# EAGLE board lisa_l (EAGLE 6.1), part 1 of 2
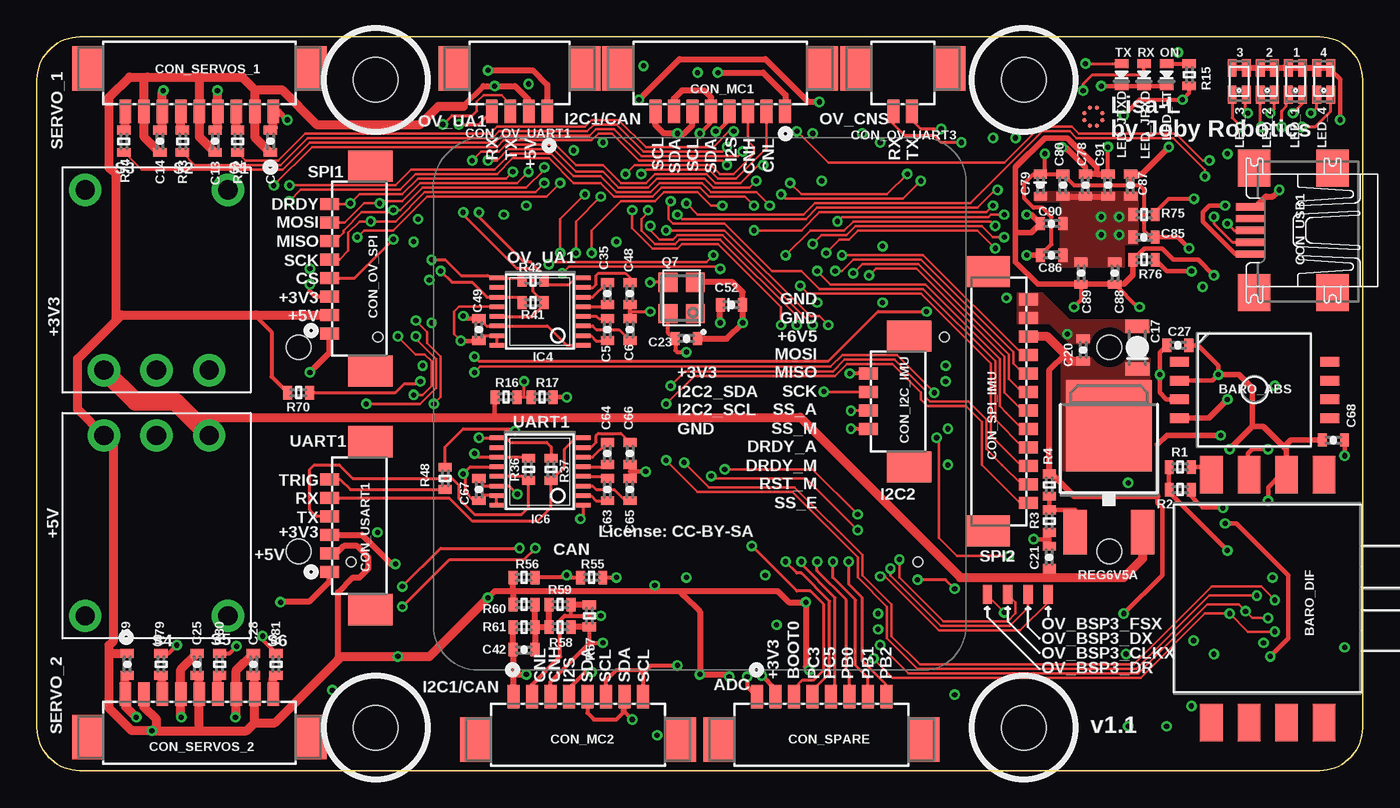
[diagram p6: board, top side]
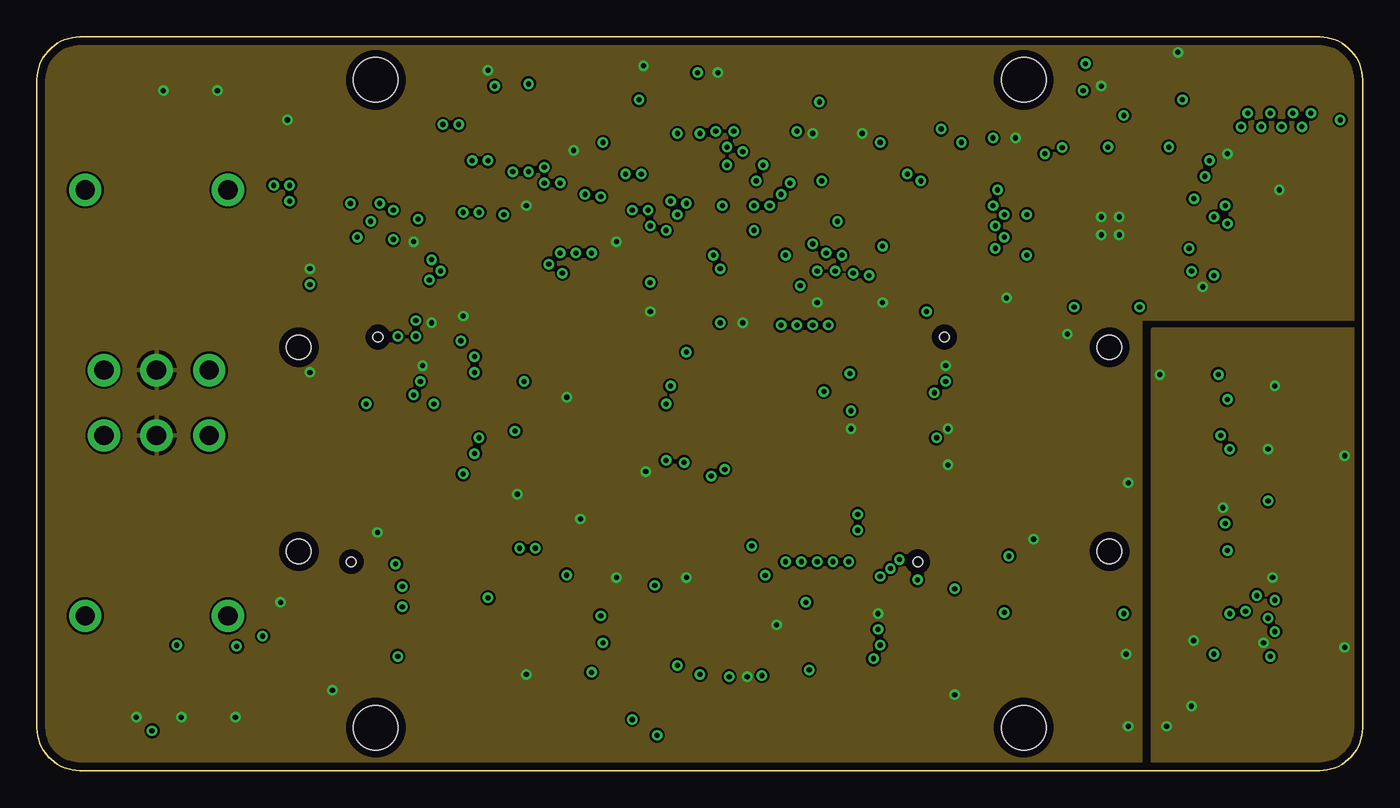
[diagram p7: board, inner layer Route2]
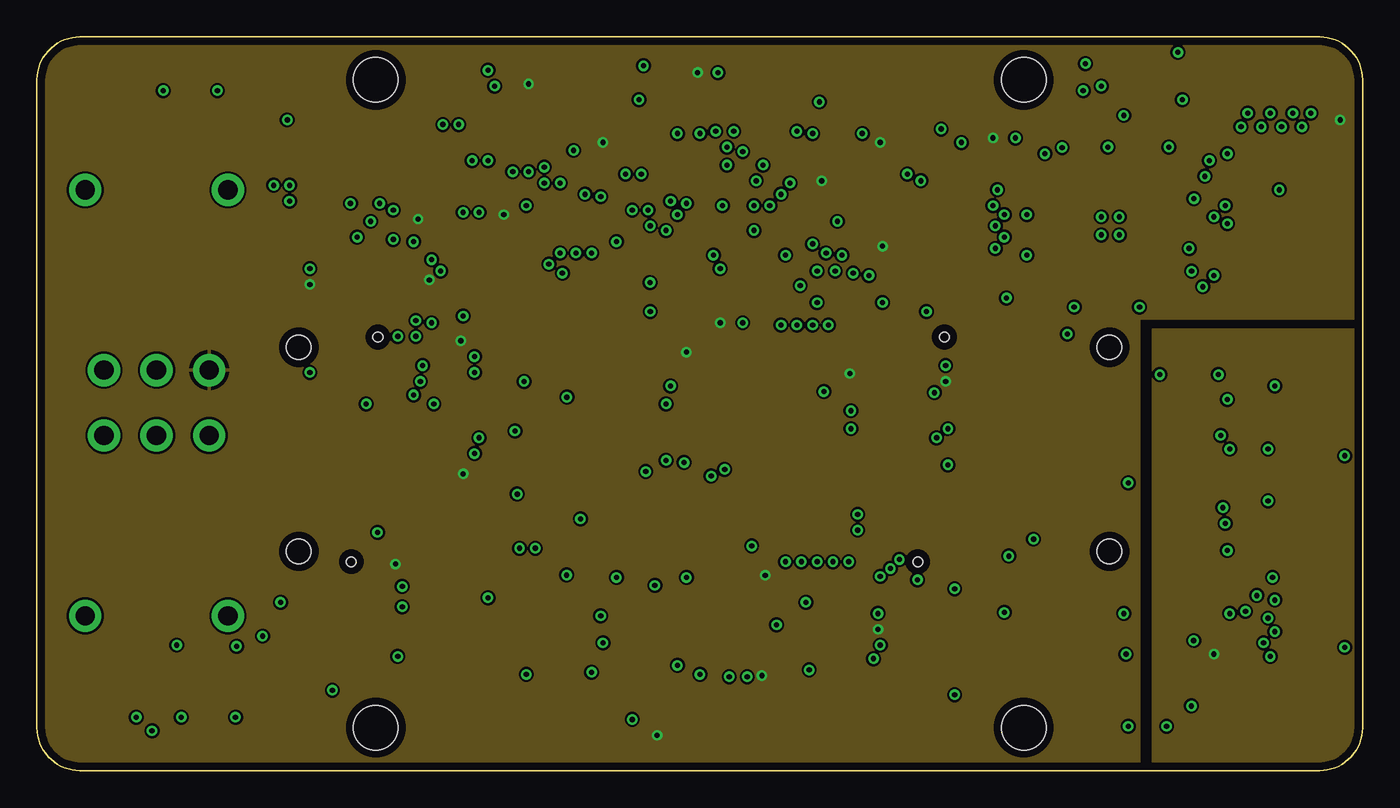
[diagram p8: board, inner layer Route15]
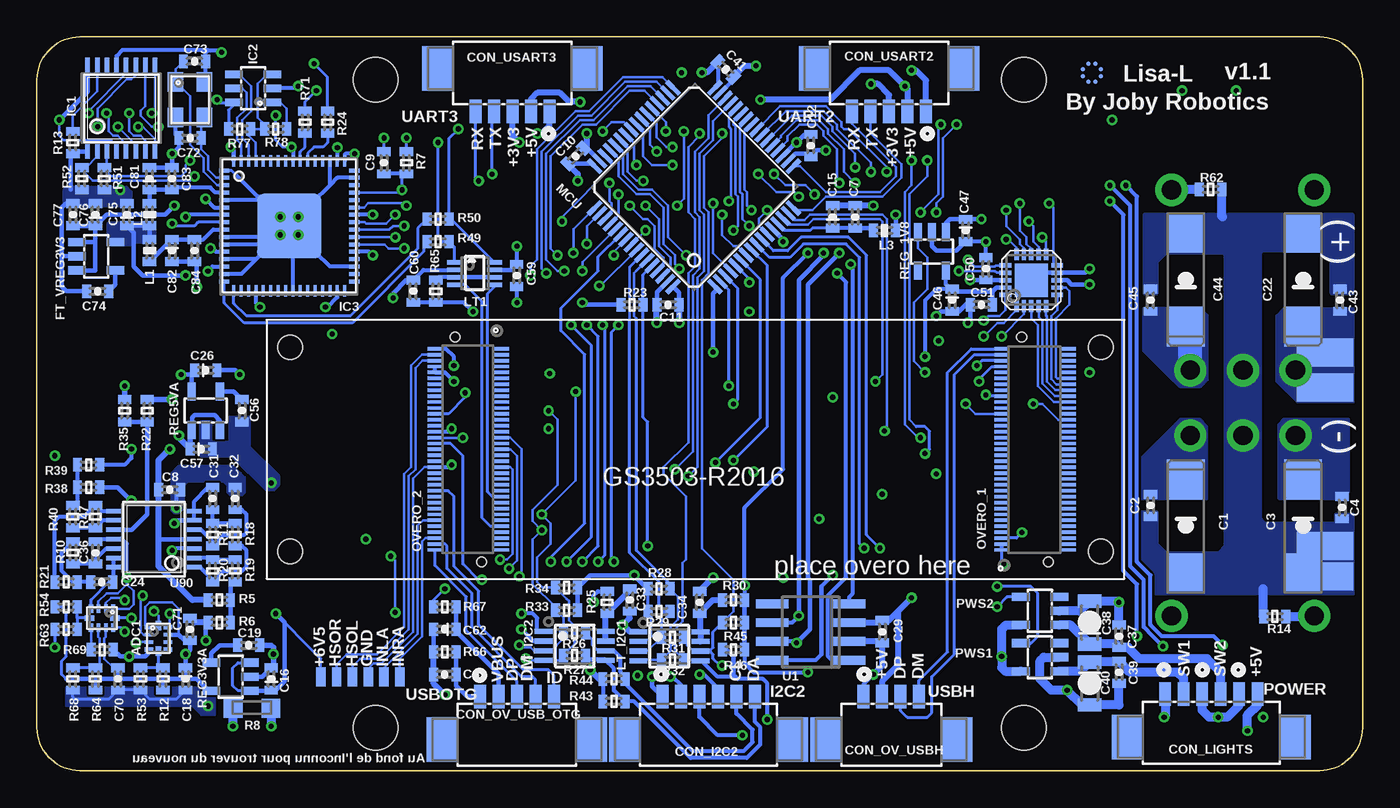
[diagram p9: board, bottom side, seen from below]

Size 89.6 x 49.6 mm. Coordinates in mm from the lower left corner, seen from the top.
Outline: 2.9,49.6 86.7,49.6 arc-90 89.6,46.7 89.6,2.9 arc-90 86.7,0 2.9,0 arc-90 0,2.9 0,46.7 arc-90 2.9,49.6
Copper layers (1*2+15*16): Top 0.035mm / dielectric 0.2mm / Route2 0.035mm / dielectric 1.5mm / Route15 0.035mm / dielectric 0.2mm / Bottom 0.035mm
Design rules: minimum track width 0.15mm, minimum drill 0.35mm, track to track 0.15mm, track to pad 0.15mm, pad to pad 0.15mm, via to via 0.15mm, smd to smd 0.15mm, copper to edge 20mil, drill to drill 8mil, minimum pad ring 0.177mm, minimum via ring 0.177mm, stop-mask expansion 4mil, vias tented up to drill 14mil, thermal gap 10mil
Net classes: 0 default: width 0.152 mm, drill 0.305 mm, clearance 0.152 mm; 1 supply: width 0.203 mm; 4 xxwide: width 0.203 mm; 5 USB: width 0.191 mm
Holes 3 mm at 66.7,46.7 66.7,2.9 22.9,46.7 22.9,2.9
bKeepout: area 19.9,43.7 to 25.9,49.7; area 63.7,43.7 to 69.7,49.7; area 19.9,-0.1 to 25.9,5.9; area 63.7,-0.1 to 69.7,5.9
tRestrict: area 63.6,43.6 to 69.8,49.8; area 63.6,-0.2 to 69.8,6; area 19.8,-0.2 to 26,6; area 19.8,43.6 to 26,49.8

## Footprints (pad centres in the part's own frame; a part is rotated, then mirrored left to right if it is on the bottom)
R-PQFP-N10 = smd 0.3 x 0.58: P$1 0.75,0.637; P$4 -0.75,0.637; P$6 -0.75,-0.637; P$9 0.75,-0.637 | smd 0.25 x 0.58: P$2 0.25,0.637; P$3 -0.25,0.637; P$7 -0.25,-0.637; P$8 0.25,-0.637 | smd 0.63 x 0.35: P$5 -0.863,0; P$10 0.863,0
CASE_1317 = smd 1.27 x 0.635: P$1 5.08,-1.905; P$2 5.08,-0.635; P$3 5.08,0.635; P$4 5.08,1.905; P$5 -5.08,1.905; P$6 -5.08,0.635; P$7 -5.08,-0.635; P$8 -5.08,-1.905
CASE1351 = smd 2.54 x 1.524: P$1 8.382,-3.81; P$2 8.382,-1.27; P$3 8.382,1.27; P$4 8.382,3.81; P$5 -8.382,3.81; P$6 -8.382,1.27; P$7 -8.382,-1.27; P$8 -8.382,-3.81
SOLD_PAD_150_75 = smd 3.81 x 1.905: P$1 0,0
7343/D = smd 2.7 x 2.55: + -3.175,0; - 3.175,0
0603-CAP = smd 0.6 x 0.9: P$1 -0.75,0; P$2 0.75,0
0603-POL-CAP = smd 0.6 x 0.9: + -0.75,0; - 0.75,0
1206-POL-CAP = smd 0.9 x 1.6: + -1.45,0; - 1.45,0
PB-53261-06 = smd 0.8 x 1.6: 1 -3.125,1.1; 2 -1.875,1.1; 3 -0.625,1.1; 4 0.625,1.1; 5 1.875,1.1; 6 3.125,1.1 | smd 2.1 x 3: MNT1 -5.675,-1.8; MNT2 5.675,-1.8
PB-53398-04 = smd 0.8 x 1.3: 1 -1.875,1.25; 2 -0.625,1.25; 3 0.625,1.25; 4 1.875,1.25 | smd 2.1 x 3: PAD1 -4.425,-1.5; PAD2 4.425,-1.5
PB-53261-08 = smd 0.8 x 1.6: 1 -4.375,1.1; 2 -3.125,1.1; 3 -1.875,1.1; 4 -0.625,1.1; 5 0.625,1.1; 6 1.875,1.1; 7 3.125,1.1; 8 4.375,1.1 | smd 2.1 x 3: MNT1 -6.925,-1.8; MNT2 6.925,-1.8
PB-53398-08 = smd 0.8 x 1.3: 1 -4.375,1.25; 2 -3.125,1.25; 3 -1.875,1.25; 4 -0.625,1.25; 5 0.625,1.25; 6 1.875,1.25; 7 3.125,1.25; 8 4.375,1.25 | smd 2.1 x 3: PAD1 -6.925,-1.5; PAD2 6.925,-1.5
PB-53261-04 = smd 0.8 x 1.6: 1 -1.875,1.1; 2 -0.625,1.1; 3 0.625,1.1; 4 1.875,1.1 | smd 2.1 x 3: MNT1 -4.425,-1.8; MNT2 4.425,-1.8
PB-53261-02 = smd 0.8 x 1.6: 1 -0.625,1.1; 2 0.625,1.1 | smd 2.1 x 3: MNT1 -3.175,-1.8; MNT2 3.175,-1.8
PB-53261-05 = smd 0.8 x 1.6: 1 -2.5,1.1; 2 -1.25,1.1; 3 0,1.1; 4 1.25,1.1; 5 2.5,1.1 | smd 2.1 x 3: MNT1 -5.05,-1.8; MNT2 5.05,-1.8
PB-53261-09 = smd 0.8 x 1.6: 1 -5,1.1; 2 -3.75,1.1; 3 -2.5,1.1; 4 -1.25,1.1; 5 0,1.1; 6 1.25,1.1; 7 2.5,1.1; 8 3.75,1.1; 9 5,1.1 | smd 2.1 x 3: MNT1 -7.55,-1.8; MNT2 7.55,-1.8
PB-53398-12 = smd 0.8 x 1.3: 1 -6.875,1.25; 2 -5.625,1.25; 3 -4.375,1.25; 4 -3.125,1.25; 5 -1.875,1.25; 6 -0.625,1.25; 7 0.625,1.25; 8 1.875,1.25; 9 3.125,1.25; 10 4.375,1.25; 11 5.625,1.25; 12 6.875,1.25 | smd 2.1 x 3: PAD1 -8.775,-1.5; PAD2 8.775,-1.5
PB-53398-06 = smd 0.8 x 1.3: 1 -3.125,1.25; 2 -1.875,1.25; 3 -0.625,1.25; 4 0.625,1.25; 5 1.875,1.25; 6 3.125,1.25 | smd 2.1 x 3: PAD1 -5.675,-1.5; PAD2 5.675,-1.5
UX60A-MB-5ST = smd 2 x 0.5: 1 2.25,1.6; 2 2.25,0.8; 3 2.25,0; 4 2.25,-0.8; 5 2.25,-1.6 | smd 2.2 x 2.5: M1 -3.3,-4.2; M2 -3.3,4.2; M3 2,4.2; M4 2,-4.2
SOT23-5 = smd 0.55 x 1.2: 1 -0.95,-1.3; 2 0,-1.3; 3 0.95,-1.3; 4 0.95,1.3; 5 -0.95,1.3
TSSOP16 = smd 0.305 x 0.991: 1 -2.275,-2.918; 2 -1.625,-2.918; 3 -0.975,-2.918; 4 -0.325,-2.918; 5 0.325,-2.918; 6 0.975,-2.918; 7 1.625,-2.918; 8 2.275,-2.918; 9 2.275,2.918; 10 1.625,2.918; 11 0.975,2.918; 12 0.325,2.918; 13 -0.325,2.918; 14 -0.975,2.918; 15 -1.625,2.918; 16 -2.275,2.918
SO23-6 = smd 0.5 x 1.2: 1 -0.95,-1.3; 2 0,-1.3; 3 0.95,-1.3; 4 0.95,1.3; 5 0,1.3; 6 -0.95,1.3
QFN64 = smd 0.75 x 0.25: P$1 -4.4,3.75; P$2 -4.4,3.25; P$3 -4.4,2.75; P$4 -4.4,2.25; P$5 -4.4,1.75; P$6 -4.4,1.25; P$7 -4.4,0.75; P$8 -4.4,0.25; P$9 -4.4,-0.25; P$10 -4.4,-0.75; P$11 -4.4,-1.25; P$12 -4.4,-1.75; P$13 -4.4,-2.25; P$14 -4.4,-2.75; P$15 -4.4,-3.25; P$16 -4.4,-3.75; P$33 4.4,-3.75; P$34 4.4,-3.25; P$35 4.4,-2.75; P$36 4.4,-2.25; P$37 4.4,-1.75; P$38 4.4,-1.25; P$39 4.4,-0.75; P$40 4.4,-0.25; P$41 4.4,0.25; P$42 4.4,0.75; P$43 4.4,1.25; P$44 4.4,1.75; P$45 4.4,2.25; P$46 4.4,2.75; P$47 4.4,3.25; P$48 4.4,3.75 | smd 0.25 x 0.75: P$17 -3.75,-4.4; P$18 -3.25,-4.4; P$19 -2.75,-4.4; P$20 -2.25,-4.4; P$21 -1.75,-4.4; P$22 -1.25,-4.4; P$23 -0.75,-4.4; P$24 -0.25,-4.4; P$25 0.25,-4.4; P$26 0.75,-4.4; P$27 1.25,-4.4; P$28 1.75,-4.4; P$29 2.25,-4.4; P$30 2.75,-4.4; P$31 3.25,-4.4; P$32 3.75,-4.4; P$49 3.75,4.4; P$50 3.25,4.4; P$51 2.75,4.4; P$52 2.25,4.4; P$53 1.75,4.4; P$54 1.25,4.4; P$55 0.75,4.4; P$56 0.25,4.4; P$57 -0.25,4.4; P$58 -0.75,4.4; P$59 -1.25,4.4; P$60 -1.75,4.4; P$61 -2.25,4.4; P$62 -2.75,4.4; P$63 -3.25,4.4; P$64 -3.75,4.4 | smd 4.35 x 4.35: P$65 0,0
OVERO = smd 1 x 0.23: ADCIN2 17.6,-2; ADCIN3 17.6,2; ADCIN4 17.6,5.2; ADCIN5 17.6,0.8; ADCIN6 17.6,0; ADCIN7 17.6,-4.4; AGND 17.6,1.2; AUXLF 17.6,6; AUXRF 17.6,4.8; EM_A1 -25.2,2; EM_A2 -20.7,2.8; EM_A3 -25.2,2.4; EM_A4 -25.2,3.2; EM_A5 -20.7,2; EM_A6 -25.2,1.6; EM_A7 -20.7,1.6; EM_A8 -20.7,2.4; EM_A9 -25.2,3.6; EM_A10 -25.2,2.8; EM_CLK -25.2,6.8; EM_D0 -25.2,1.2; EM_D1 -25.2,0; EM_D2 -20.7,1.2; EM_D3 -20.7,0.4; EM_D4 -20.7,-0.4; EM_D5 -20.7,-1.2; EM_D6 -25.2,-0.8; EM_D7 -25.2,-1.6; EM_D8 -25.2,0.4; EM_D9 -25.2,0.8; EM_D10 -20.7,0.8; EM_D11 -20.7,0; EM_D12 -20.7,-0.8; EM_D13 -25.2,-0.4; EM_D14 -25.2,-1.2; EM_D15 -20.7,-1.6; EM_NADV_ALE -20.7,4.4; EM_NBE0 -25.2,4.8; EM_NBE1 -25.2,6.4; EM_NCS0 -25.2,5.2; EM_NCS1 -25.2,4.4; EM_NCS4 -20.7,5.2; EM_NCS5_ETH0 -20.7,5.6; EM_NCS6 -25.2,5.6; EM_NOE -20.7,4; EM_NWE -20.7,4.8; EM_NWP -25.2,4; EM_WAIT0 -25.2,6; GND -20.7,6; GND@33 -20.7,-6; GND@56 17.6,-1.2; GND@70 17.6,-6.8; GPIO0_WAKEUP 13.1,-3.6; GPIO12_MMC3_CLK -25.2,-5.2; GPIO13_MMC3_CMD -20.7,-2; GPIO14_MMC3_DAT4 -20.7,-4.4; GPIO17_MMC3_D3 -20.7,-5.2; GPIO18_MMC3_D0 -20.7,-3.2; GPIO19_MMC3_D1 -25.2,-6.8; GPIO20_MMC3_D2 -25.2,-5.6; GPIO21_MMC3_DAT7 -20.7,-4.8; GPIO22_MMC3_DAT6 -25.2,-6.4; GPIO23_MMC3_DAT5 -25.2,-6; GPIO64_ETH0_NRESET -20.7,3.2; GPIO65_ETH1_IRQ1 -20.7,3.6; GPIO66_L_PCLK 13.1,5.6; GPIO67_L_LCLK 13.1,6.8; GPIO68_L_FCLK 13.1,6.4; GPIO69_L_BIAS 17.6,4; GPIO70_L_DD00 13.1,-6; GPIO71_L_DD01 13.1,-6.4; GPIO72_L_DD02 13.1,-4.8; GPIO73_L_DD03 13.1,-5.6; GPIO74_L_DD04 13.1,-4.4; GPIO75_L_DD05 13.1,-5.2; GPIO76_L_DD06 13.1,6; GPIO77_L_DD07 13.1,4.4; GPIO78_L_DD08 13.1,4.8; GPIO79_L_DD09 13.1,4; GPIO80_L_DD10 13.1,-2.8; GPIO81_L_DD11 13.1,-2.4; GPIO82_L_DD12 17.6,-2.8; GPIO83_L_DD13 13.1,-0.4; GPIO84_L_DD14 13.1,0.4; GPIO85_L_DD15 13.1,0.8; GPIO86_L_DD16 17.6,3.6; GPIO87_L_DD17 13.1,2.4; GPIO88_L_DD18 13.1,2.8; GPIO89_L_DD19 13.1,3.6; GPIO90_L_DD20 17.6,3.2; GPIO91_L_DD21 13.1,2; GPIO92_L_DD22 13.1,-1.2; GPIO93_L_DD23 17.6,-3.2; GPIO114_SPI1_NIRQ -25.2,-4.8; GPIO127_TS_IRQ 13.1,-4; GPIO128_GPS_PPS 13.1,-1.6; GPIO144_GPT9_PWM 13.1,0; GPIO145_GPT10_PWM 17.6,-0.8; GPIO146_GPT11_PWM 13.1,1.2; GPIO147_GPT8_PWM 13.1,-0.8; GPIO148_TXD1 -20.7,-2.4; GPIO149_MMC3_CD -25.2,-2.8; GPIO150_MMC3_WP -25.2,-2.4; GPIO151_RXD1 -25.2,-2; GPIO163_IR_CTS3 13.1,1.6; GPIO165_IR_RXD3 13.1,5.2; GPIO166_IR_TXD3 13.1,3.2; GPIO168_USBH_CPEN -20.7,-4; GPIO170_HDQ_1WIRE 17.6,2.4; GPIO171_SPI1_CLK -25.2,-4; GPIO172_SPI1_MOSI -25.2,-3.6; GPIO173_SPI1_MISO -25.2,-3.2; GPIO174_SPI1_CS0 -20.7,-3.6; GPIO175_SPI1_CS1 -25.2,-4.4; GPIO176_ETH0_IRQ -20.7,-2.8; GPIO184_I2C3_SCL 13.1,-2; GPIO185_I2C3_SDA 13.1,-3.2; HSOLF 17.6,-6; HSORF 17.6,-6.4; MIC_MAIN_MF 17.6,-1.6; MIC_SUB_MF 17.6,5.6; N_MANUAL_RESET 13.1,-6.8; NC@62 17.6,-3.6; NC@63 17.6,-4; POWERON 17.6,-4.8; PWM0 17.6,4.4; PWM1 17.6,1.6; SYSEN 17.6,-2.4; USBH_DM -20.7,-6.8; USBH_DP -20.7,-6.4; USBH_VBUS -20.7,-5.6; USBOTG_DM 17.6,6.4; USBOTG_DP 17.6,6.8; USBOTG_ID 17.6,2.8; USBOTG_VBUS 17.6,-0.4; VBACKUP 17.6,0.4; VSYSTEM@1 -20.7,6.8; VSYSTEM@2 -20.7,6.4; VSYSTEM@66 17.6,-5.2; VSYSTEM@67 17.6,-5.6 | hole 1.65: 27.4,6.9; 27.4,-6.9; -27.4,6.9; -27.4,-6.9 | hole 0.65: -23.85,7.6; -22.05,-7.6; 14.45,7.6; 16.25,-7.6
JOBY_LOGO_12MIL = smd 0.305 x 0.305: 1 -0.229,0.61; 2 0.229,0.61; 3 0.61,0.229; 4 0.61,-0.229; 5 0.229,-0.61; 6 -0.229,-0.61; 7 -0.61,-0.229; 8 -0.61,0.229
0603-IND = smd 0.6 x 0.9: P$1 -0.75,0; P$2 0.75,0
DUO_LED = smd 1.2 x 0.6: 1 0.9,0.475; 2 -0.9,0.475; 3 -0.9,-0.475; 4 0.9,-0.475
0603-LED = smd 0.6 x 0.9: A 0.75,0; C -0.75,0
US8 = smd 0.3 x 1: 1 -0.75,-1.35; 2 -0.25,-1.35; 3 0.25,-1.35; 4 0.75,-1.35; 5 0.75,1.35; 6 0.25,1.35; 7 -0.25,1.35; 8 -0.75,1.35
LFCSP-20 = smd 0.8 x 0.3: P$1 -1.75,1; P$2 -1.75,0.5; P$3 -1.75,0; P$4 -1.75,-0.5; P$5 -1.75,-1; P$11 1.75,-1; P$12 1.75,-0.5; P$13 1.75,0; P$14 1.75,0.5; P$15 1.75,1 | smd 0.3 x 0.8: P$6 -1,-1.75; P$7 -0.5,-1.75; P$8 0,-1.75; P$9 0.5,-1.75; P$10 1,-1.75; P$16 1,1.75; P$17 0.5,1.75; P$18 0,1.75; P$19 -0.5,1.75; P$20 -1,1.75 | smd 2.25 x 2.25: P$21 0,0
TSSOP_B3 = smd 1.2 x 0.35: 1 -2.925,0.975; 2 -2.925,0.325; 3 -2.925,-0.325; 4 -2.925,-0.975; 5 1.275,-0.975; 6 1.275,-0.325; 7 1.275,0.325; 8 1.275,0.975
LQFP64 = smd 1.2 x 0.3: 1 -5.75,3.75; 2 -5.75,3.25; 3 -5.75,2.75; 4 -5.75,2.25; 5 -5.75,1.75; 6 -5.75,1.25; 7 -5.75,0.75; 8 -5.75,0.25; 9 -5.75,-0.25; 10 -5.75,-0.75; 11 -5.75,-1.25; 12 -5.75,-1.75; 13 -5.75,-2.25; 14 -5.75,-2.75; 15 -5.75,-3.25; 16 -5.75,-3.75; 33 5.75,-3.75; 34 5.75,-3.25; 35 5.75,-2.75; 36 5.75,-2.25; 37 5.75,-1.75; 38 5.75,-1.25; 39 5.75,-0.75; 40 5.75,-0.25; 41 5.75,0.25; 42 5.75,0.75; 43 5.75,1.25; 44 5.75,1.75; 45 5.75,2.25; 46 5.75,2.75; 47 5.75,3.25; 48 5.75,3.75 | smd 0.3 x 1.2: 17 -3.75,-5.75; 18 -3.25,-5.75; 19 -2.75,-5.75; 20 -2.25,-5.75; 21 -1.75,-5.75; 22 -1.25,-5.75; 23 -0.75,-5.75; 24 -0.25,-5.75; 25 0.25,-5.75; 26 0.75,-5.75; 27 1.25,-5.75; 28 1.75,-5.75; 29 2.25,-5.75; 30 2.75,-5.75; 31 3.25,-5.75; 32 3.75,-5.75; 49 3.75,5.75; 50 3.25,5.75; 51 2.75,5.75; 52 2.25,5.75; 53 1.75,5.75; 54 1.25,5.75; 55 0.75,5.75; 56 0.25,5.75; 57 -0.25,5.75; 58 -0.75,5.75; 59 -1.25,5.75; 60 -1.75,5.75; 61 -2.25,5.75; 62 -2.75,5.75; 63 -3.25,5.75; 64 -3.75,5.75
SOT23-5L = smd 0.55 x 1.2: 1 -0.95,-1.3; 2 0,-1.3; 3 0.95,-1.3; 4 0.95,1.3; 5 -0.95,1.3
ABM8 = smd 1.3 x 1.05: P$1 -1.2,-0.975; P$2 1.2,-0.975; P$3 1.2,0.975; P$4 -1.2,0.975
ASE_OSCILLATOR = smd 1.295 x 1.27: 1 -1.041,-0.902; 2 1.067,-0.902; 3 1.067,0.927; 4 -1.041,0.927
0603-RES = smd 0.6 x 0.9: P$1 -0.75,0; P$2 0.75,0
DPACK = smd 1.6 x 3: 1 -2.28,-4.8; 3 2.28,-4.8 | smd 5.8 x 6.2: 4 0,2.38
SOT-23-5 = smd 0.55 x 1.2: 1 -0.95,-1.3; 2 0,-1.3; 3 0.95,-1.3; 4 0.95,1.3; 5 -0.95,1.3
PTH_TH = drill 1.3 pad 2.184: P$1 -6.096,3.556; P$2 -6.096,0; P$3 -6.096,-3.556; P$4 6.096,-4.826; P$5 6.096,4.826
SO-08 = smd 0.6 x 2.2: 1 -1.905,-2.6; 2 -0.635,-2.6; 3 0.635,-2.6; 4 1.905,-2.6; 5 1.905,2.6; 6 0.635,2.6; 7 -0.635,2.6; 8 -1.905,2.6
TSSOP14 = smd 0.305 x 0.991: 1 -1.905,-2.718; 2 -1.27,-2.718; 3 -0.635,-2.718; 4 0,-2.718; 5 0.635,-2.718; 6 1.27,-2.718; 7 1.905,-2.718; 8 1.905,2.718; 9 1.27,2.718; 10 0.635,2.718; 11 0,2.718; 12 -0.635,2.718; 13 -1.27,2.718; 14 -1.905,2.718
SOLDER_PAD_SMALL = smd 1.27 x 0.635: P$1 0,0
GND-GNDA = smd 1.27 x 1.27: GND -1.27,0; GNDA 1.27,0

## Placement (x,y rotation side)
ADC1  ADS1114  [R-PQFP-N10]  81.39,8.94 90 bottom
ADC2  ADS1114  [R-PQFP-N10]  85.2,10.31 0 bottom
BARO_ABS  MPX6115  [CASE_1317]  82.3,25.73 180 top
BARO_DIF  MPXV5004DP  [CASE1351]  83.19,11.63 90 top
BAT_IN  SOLDER_PAD150_75  [SOLD_PAD_150_75]  2.52,28.27 0 bottom
BAT_IN1  SOLDER_PAD150_75  [SOLD_PAD_150_75]  2.52,25.91 0 bottom
C1  100uF/20V  [7343/D]  11.95,16.51 270 bottom
C2  100nF  [0603-CAP]  14.33,17.93 270 bottom
C3  220uF/10V  [7343/D]  4.02,16.51 270 bottom
C4  100nF  [0603-CAP]  1.38,17.78 270 bottom
C5  100nF  [0603-CAP]  38.56,29.82 90 top
C6  100nF  [0603-CAP]  40.09,29.82 270 top
C7  10nF  [0603-CAP]  34.29,37.44 270 bottom
C8  100nF  [0603-CAP]  80.62,19 0 bottom
C9  100nF  [0603-CAP]  66.15,41.09 270 bottom
C10  100nF  [0603-CAP]  53.19,41.55 225 bottom
C11  100nF  [0603-CAP]  46.94,31.49 0 bottom
C12  100nF  [0603-CAP]  37.29,42.26 90 bottom
C13  100nF  [0603-CAP]  12.04,42.54 270 top
C14  100nF  [0603-CAP]  8.31,42.54 270 top
C15  1uF  [0603-POL-CAP]  35.82,37.44 90 bottom
C16  2.2uF/Low ESR  [0603-POL-CAP]  73.77,6.19 90 bottom
C17  22uF/10V  [1206-POL-CAP]  74.38,28.6 90 top
C18  4.7uF/10V/Low ESR  [0603-POL-CAP]  79.56,6.19 270 bottom
C19  10nF/16V  [0603-CAP]  75.29,8.48 0 bottom
C20  100nF  [0603-CAP]  70.72,28.44 90 top
C21  100nF  [0603-CAP]  68.43,14.42 90 top
C22  100uF/20V  [7343/D]  4.02,33.2 90 bottom
C23  10nF  [0603-CAP]  43.9,29.21 180 top
C24  330nF  [0603-CAP]  85.22,12.75 180 bottom
C25  100nF  [0603-CAP]  10.82,7.18 270 top
C26  4.7uF/10V/Low ESR  [0603-POL-CAP]  78.19,27.07 0 bottom
C27  100nF  [0603-CAP]  77.12,28.75 180 top
C28  100nF  [0603-CAP]  14.63,7.18 270 top
C29  100nF  [0603-CAP]  32.47,9.39 270 bottom
C30  100nF  [0603-CAP]  15.78,42.54 270 top
C31  330nF  [0603-CAP]  77.73,18.39 270 bottom
C32  170nF  [0603-CAP]  76.2,18.39 270 bottom
C33  100nF  [0603-CAP]  49.53,11.53 270 bottom
C34  100nF  [0603-CAP]  44.81,11.38 90 bottom
C35  100nF  [0603-CAP]  38.56,32.25 90 top
C36  170nF  [0603-CAP]  85.65,14.73 270 bottom
C37  100nF  [0603-CAP]  16.46,9.09 90 bottom
C38  33uF/6V  [1206-POL-CAP]  18.44,10 90 bottom
C39  100nF  [0603-CAP]  16.46,6.65 270 bottom
C40  33uF/6V  [1206-POL-CAP]  18.44,5.89 270 bottom
C41  100nF  [0603-CAP]  43.04,47.41 135 bottom
C42  4.7nF  [0603-CAP]  32.92,8.18 0 top
C43  100nF  [0603-CAP]  1.53,31.8 90 bottom
C44  220uF/10V  [7343/D]  11.95,33.2 90 bottom
C45  100nF  [0603-CAP]  14.33,31.8 90 bottom
C46  10uF  [0603-POL-CAP]  27.74,31.8 270 bottom
C47  10uF  [0603-POL-CAP]  26.83,36.52 270 bottom
C48  100nF  [0603-CAP]  40.09,32.25 90 top
C49  100nF  [0603-CAP]  29.87,29.82 90 top
C50  100nF  [0603-CAP]  25.46,33.93 90 bottom
C51  100nF  [0603-CAP]  25.76,31.49 180 bottom
C52  4.7uF/10V/Low ESR  [0603-POL-CAP]  46.94,31.49 0 top
C56  10nF/16V  [0603-CAP]  75.75,24.33 270 bottom
C57  2.2uF/Low ESR  [0603-POL-CAP]  78.49,21.74 0 bottom
C59  100nF  [0603-CAP]  57.18,33.47 270 bottom
C60  100nF  [0603-CAP]  64.16,32.41 90 bottom
C61  10nF  [0603-CAP]  62.03,6.5 180 bottom
C62  4.7uF  [0603-POL-CAP]  62.03,9.55 180 bottom
C63  100nF  [0603-CAP]  38.56,19 90 top
C64  100nF  [0603-CAP]  38.56,21.43 90 top
C65  100nF  [0603-CAP]  40.09,19 90 top
C66  100nF  [0603-CAP]  40.09,21.43 270 top
C67  100nF  [0603-CAP]  29.87,19 270 top
C68  100nF  [0603-CAP]  87.63,22.35 0 top
C69  100nF  [0603-CAP]  6.1,7.18 90 top
C70  100nF  [0603-CAP]  84.13,6.19 270 bottom
C71  100nF  [0603-CAP]  79.25,9.55 90 bottom
C72  30pF  [0603-CAP]  79.25,42.77 0 bottom
C73  30pF  [0603-CAP]  78.95,47.95 180 bottom
C74  470pF  [0603-CAP]  85.5,32.41 0 bottom
C75  4.7uF/low ESR  [0603-POL-CAP]  83.52,37.59 90 bottom
C76  2.2uF/low ESR  [0603-POL-CAP]  85.65,37.59 90 bottom
C77  100nF  [0603-CAP]  87.18,37.59 270 bottom
C78  100nF  [0603-CAP]  70.87,39.57 90 top
C79  4.7uF  [0603-POL-CAP]  67.82,39.57 270 top
C80  100nF  [0603-CAP]  69.35,39.57 90 top
C81  4.7uF  [0603-POL-CAP]  82,40.03 90 bottom
C82  4.7uF  [0603-POL-CAP]  80.47,35.15 270 bottom
C83  100nF  [0603-CAP]  80.47,40.03 90 bottom
C84  100nF  [0603-CAP]  78.95,35.15 270 bottom
C85  100nF  [0603-CAP]  74.83,36.06 0 top
C86  100nF  [0603-CAP]  68.58,34.85 180 top
C87  100nF  [0603-CAP]  73.92,39.57 90 top
C88  100nF  [0603-CAP]  72.85,33.63 270 top
C89  100nF  [0603-CAP]  70.57,33.63 270 top
C90  100nF  [0603-CAP]  68.58,36.98 180 top
C91  100nF  [0603-CAP]  72.39,39.57 90 top
CON_I2C2  0  [PB-53261-06]  44.2,3.91 0 bottom
CON_I2C_IMU  [PB-53398-04]  57.46,24.96 90 top
CON_LIGHTS  0  [PB-53261-06]  10.22,4.06 0 bottom
CON_MC1  0  [PB-53261-08]  46.18,45.67 180 top
CON_MC2  0  [PB-53261-08]  36.58,3.91 0 top
CON_OV_SPI  0  [PB-53398-08]  21.04,33.93 90 top
CON_OV_UART1  0  [PB-53261-04]  32.62,45.67 180 top
CON_OV_UART3  0  [PB-53261-02]  58.53,45.67 180 top
CON_OV_USB_OTG  0  [PB-53261-05]  57.15,3.91 0 bottom
CON_OV_USBH  0  [PB-53261-04]  31.86,3.91 0 bottom
CON_SERVOS_1  0  [PB-53261-09]  10.98,45.67 180 top
CON_SERVOS_2  0  [PB-53261-09]  10.98,4.06 0 top
CON_SPARE  0  [PB-53261-08]  53.04,3.91 0 top
CON_SPI_IMU  0  [PB-53398-12]  65.77,24.96 270 top
CON_USART1  0  [PB-53398-06]  21.04,16.56 90 top
CON_USART2  0  [PB-53261-05]  32.01,45.67 180 bottom
CON_USART3  0  [PB-53261-05]  57.46,45.67 180 bottom
CON_USB1  MINI-USB-UX60A-MB-5ST  [UX60A-MB-5ST]  84.28,36.52 180 top
FT_VREG3V3  MIC5219  [SOT23-5]  85.6,34.77 270 bottom
GND_IN  SOLDER_PAD150_75  [SOLD_PAD_150_75]  2.52,15.19 0 bottom
GND_IN1  SOLDER_PAD150_75  [SOLD_PAD_150_75]  2.52,13.13 180 bottom
IC1  STP08CP05  [TSSOP16]  83.9,44.78 0 bottom
IC2  93C46-SO23-6  [SO23-6]  74.99,46.12 90 bottom
IC3  FT2232HQ  [QFN64]  72.55,36.83 0 bottom
IC4  MAX3221EUE  [TSSOP16]  33.99,31.04 90 top
IC6  MAX3221CUE  [TSSOP16]  33.99,20.22 90 top
J3&4  OVERO  [OVERO]  45.09,21.72 180 bottom
JL1  JOBY_LOGO-12MIL  [JOBY_LOGO_12MIL]  71.4,44.22 0 top
JL2  JOBY_LOGO-12MIL  [JOBY_LOGO_12MIL]  18.29,47.19 0 bottom
L1  [0603-IND]  82,35.15 270 bottom
L2  [0603-IND]  82,37.59 90 bottom
L3  [0603-IND]  32.31,36.52 180 bottom
LED_1  LED_DUO  [DUO_LED]  85.07,46.61 90 top
LED_2  LED_DUO  [DUO_LED]  83.16,46.61 90 top
LED_3  LED_DUO  [DUO_LED]  81.26,46.61 90 top
LED_4  LED_DUO  [DUO_LED]  86.97,46.61 90 top
LED_FT  [0603-LED]  76.36,47.04 90 top
LED_JRXD  [0603-LED]  74.83,47.04 90 top
LED_JTXD  [0603-LED]  73.31,47.04 90 top
LT1  TXS0102DCU  [US8]  60.02,33.6 270 bottom
LT_3  AD3308BCPZ  [LFCSP-20]  22.39,33.16 90 bottom
LT_I2C1  PCA9306DP  [TSSOP_B3]  46.03,8.4 0 bottom
LT_I2C2  PCA9306DP  [TSSOP_B3]  52.43,8.43 0 bottom
MCU  STM32-M-64  [LQFP64]  45.19,39.45 135 bottom
PWS1  TPS2051B  [SOT23-5L]  21.8,7.67 90 bottom
PWS2  TPS2051B  [SOT23-5L]  21.8,10.79 90 bottom
Q3  12Mhz  [ABM8]  79.25,45.36 270 bottom
Q7  8MHz  [ASE_OSCILLATOR]  43.59,31.95 90 top
R1  100k  [0603-RES]  77.27,20.52 180 top
R2  130k  [0603-RES]  77.27,19 0 top
R3  3.9k  [0603-RES]  68.43,16.86 90 top
R4  1k  [0603-RES]  68.43,19.3 90 top
R5  6.1k  [0603-RES]  77.27,11.53 0 bottom
R6  1k  [0603-RES]  77.27,10 180 bottom
R7  10k  [0603-RES]  64.62,41.09 90 bottom
R10  10k  [0603-RES]  87.18,14.73 270 bottom
R11  10k  [0603-RES]  77.73,15.95 270 bottom
R12  10k  [0603-RES]  81.08,6.19 90 bottom
R13  2k  [0603-RES]  87.18,42.47 90 bottom
R14  353R  [0603-RES]  5.93,10.41 0 bottom
R15  470R  [0603-RES]  77.88,47.04 270 top
R16  100k  [0603-RES]  31.7,25.24 180 top
R17  16k  [0603-RES]  34.14,25.24 180 top
R18  10k  [0603-RES]  76.2,15.95 270 bottom
R19  100k  [0603-RES]  76.2,13.51 270 bottom
R20  130k  [0603-RES]  77.73,13.51 90 bottom
R21  10k  [0603-RES]  87.63,12.75 180 bottom
R22  100k  [0603-RES]  82.15,24.33 90 bottom
R23  10k  [0603-RES]  49.38,31.49 0 bottom
R24  470R  [0603-RES]  69.96,43.84 270 bottom
R25  200k  [0603-RES]  51.06,11.38 90 bottom
R26  0/DNP  [0603-RES]  53.27,9.32 0 bottom
R27  0/DNP  [0603-RES]  53.27,7.79 0 bottom
R28  4.7k  [0603-RES]  47.55,12.29 0 bottom
R29  4.7k  [0603-RES]  47.55,10.77 0 bottom
R30  200k  [0603-RES]  42.52,11.53 180 bottom
R31  0/DNP  [0603-RES]  46.64,9.01 0 bottom
R32  0/DNP  [0603-RES]  46.64,7.49 0 bottom
R33  4.7k  [0603-RES]  53.8,10.84 0 bottom
R34  4.7k  [0603-RES]  53.8,12.37 0 bottom
R35  136k  [0603-RES]  83.67,24.33 270 bottom
R36  0/DNP  [0603-RES]  33.23,20.37 90 top
R37  0/DNP  [0603-RES]  34.75,20.37 90 top
R38  1.5k  [0603-RES]  86.11,19.15 180 bottom
R39  1k  [0603-RES]  86.11,20.67 0 bottom
R40  100k  [0603-RES]  87.18,17.17 90 bottom
R41  0/DNP  [0603-RES]  33.53,31.65 0 top
R42  0/DNP  [0603-RES]  33.53,33.17 0 top
R43  4.7k  [0603-RES]  50.6,4.67 180 bottom
R44  4.7k  [0603-RES]  50.6,6.19 180 bottom
R45  4.7k  [0603-RES]  42.52,10 180 bottom
R46  4.7k  [0603-RES]  42.52,8.18 180 bottom
R47  136k  [0603-RES]  85.65,17.17 270 bottom
R48  0/DNP  [0603-RES]  27.59,19.76 270 top
R49  0R  [0603-RES]  62.49,35.76 0 bottom
R50  0R  [0603-RES]  62.49,37.28 0 bottom
R51  2k  [0603-RES]  85.04,40.03 90 bottom
R52  2k  [0603-RES]  86.57,40.03 90 bottom
R53  10k  [0603-RES]  82.61,6.19 90 bottom
R54  10k  [0603-RES]  87.63,11.07 0 bottom
R55  10k  [0603-RES]  37.49,13.05 180 top
R56  0/DNP  [0603-RES]  32.92,13.05 180 top
R57  120R/DNP  [0603-RES]  37.34,10.46 90 top
R58  60R/DNP  [0603-RES]  35.36,9.7 180 top
R59  60R/DNP  [0603-RES]  35.36,11.22 0 top
R60  4.7k/DNP  [0603-RES]  32.92,11.22 0 top
R61  4.7k/DNP  [0603-RES]  32.92,9.7 180 top
R62  1k89  [0603-RES]  10.27,39.29 180 bottom
R63  10k  [0603-RES]  87.63,9.55 0 bottom
R64  10k/DNP  [0603-RES]  85.65,6.19 270 bottom
R65  100R  [0603-RES]  62.64,32.41 270 bottom
R66  120R  [0603-RES]  62.03,8.02 0 bottom
R67  120R  [0603-RES]  62.03,11.07 0 bottom
R68  10k/DNP  [0603-RES]  87.18,6.19 90 bottom
R69  0R  [0603-RES]  85.2,8.18 180 bottom
R70  0/DNP  [0603-RES]  17.68,25.55 0 top
R71  470R  [0603-RES]  71.48,43.84 270 bottom
R72  100R  [0603-RES]  13.57,42.54 270 top
R73  100R  [0603-RES]  9.83,42.54 270 top
R74  100R  [0603-RES]  5.87,42.54 270 top
R75  12k  [0603-RES]  74.83,37.59 0 top
R76  12k  [0603-RES]  74.83,34.54 0 top
R77  10k  [0603-RES]  75.9,43.38 180 bottom
R78  2k  [0603-RES]  73.46,43.38 0 bottom
R79  100R  [0603-RES]  8.39,7.18 90 top
R80  100R  [0603-RES]  12.35,7.18 90 top
R81  100R  [0603-RES]  16.16,7.18 90 top
REG3V3A  LP2992  [SOT23-5]  76.51,6.35 90 bottom
REG5VA  LP2992  [SOT23-5]  78.19,24.33 0 bottom
REG6V5A  LM317MBDT  [DPACK]  72.46,20.93 0 top
REG_1V8  MIC5247-1.8V  [SOT-23-5]  29.11,35.1 180 bottom
REG_3V3D  PTHTH  [PTH_TH]  8.08,33.17 90 top
REG_5VD  PTHTH  [PTH_TH]  8.08,16.56 270 top
U1  MCP2551SN  [SO-08]  37.29,9.37 90 bottom
U90  AD8554ARU  [TSSOP14]  81.69,15.64 90 bottom
U$1  SOLDER_PAD  [SOLDER_PAD_SMALL]  70.41,6.35 90 bottom
U$2  SOLDER_PAD  [SOLDER_PAD_SMALL]  69.35,6.35 90 bottom
U$3  SOLDER_PAD  [SOLDER_PAD_SMALL]  68.28,6.35 270 bottom
U$4  SOLDER_PAD  [SOLDER_PAD_SMALL]  67.21,6.35 90 bottom
U$5  SOLDER_PAD  [SOLDER_PAD_SMALL]  66.15,6.35 270 bottom
U$6  SOLDER_PAD  [SOLDER_PAD_SMALL]  65.08,6.35 270 bottom
U$7  SOLDER_PAD  [SOLDER_PAD_SMALL]  68.36,11.91 270 top
U$8  SOLDER_PAD  [SOLDER_PAD_SMALL]  66.98,11.91 270 top
U$9  SOLDER_PAD  [SOLDER_PAD_SMALL]  65.61,11.91 270 top
U$10  SOLDER_PAD  [SOLDER_PAD_SMALL]  64.24,11.91 270 top
~NUDEV~1  GND-GNDA  [GND-GNDA]  75.06,4.21 180 bottom

## Tracks (layer width: path | path; a pad name or v marks a point on that pad's centre or on a via)
+1V8  (via drill 0.35)
  Top 0.203: v29.57,27.99 29.88,27.68 53.5,27.68 56.85,31.04 v60.13,31.04
  Bottom 0.254: v29.57,27.99 29.57,31.78 28.8,32.55 C46.+ | C60.P$1 R65.P$2 60.82,31.66 60.75,31.66 v60.13,31.04 | 27.82,32.55 28.16,32.89 REG_1V8.5
  Bottom 0.305: LT_3.P$19 24.75,32.66 25.01,32.39 | C51.P$1 25.01,32.39 | 25.01,32.39 27.74,32.39 C46.+ 27.82,32.55
+3V3  (via drill 0.35)
  Top 0.152: IC4.12 28.52,31.36 28.2,31.04 28.2,29.51 v28.66,29.05
  Top 0.203: IC6.16 IC6.15 30.22,18.59 C67.P$2 29.56,18.25 28.96,18.84 28.96,19.91 v28.81,20.06 29.28,20.54 IC6.12 | C49.P$1 30.22,29.41 IC4.15 IC4.16
  Top 0.254: Q7.4 42.66,29.59 43.05,29.21 C23.P$2 43.15,28.43 43.29,28.29 v43.9,28.29 | C52.+ | CON_I2C_IMU.4 v54.95,26.84 v54.94,26.85
  Top 0.305: LED_4.1 87.47,47.51 87.47,47.35 88.09,46.73 v88.09,43.99 | CON_OV_SPI.3 18.8,32.06 18.45,32.41 v18.45,32.86 | C49.P$1 29.86,29.05 v28.66,29.05 | v49,6.42 49.91,5.51 CON_SPARE.2
  Top 0.406: LED_3.1 LED_3.4 LED_2.1 LED_2.4 LED_1.1 LED_1.4 LED_4.1 LED_4.4 | CON_USART1.3 21.96,15.93 23.93,13.97 v24.24,13.97 | v46.18,30.27 C52.+
  Bottom 0.152: IC1.4 84.23,42.26 84.59,42.62 87.79,42.62 88.09,42.92 v88.09,43.99 | R29.P$1 48.09,10.55 48.09,9.09 48.45,8.73 LT_I2C1.2
  Bottom 0.203: R29.P$1 R28.P$1 | R7.P$2 v64.62,42.77 | J3&4.VSYSTEM@1 24.39,14.12 v24.24,13.97
  Bottom 0.254: J3&4.VSYSTEM@1 J3&4.VSYSTEM@2 | J3&4.VSYSTEM@67 J3&4.VSYSTEM@66 62.03,26.92 v61.42,26.31 | MCU.32 43.58,46.36 C41.P$2 | LT_I2C2.2 56.06,8.75 v56.85,9.55 | C59.P$1 57.15,34.25 v57.15,35.45 | R28.P$1 48.31,12.29 | CON_I2C2.3 44.83,3.62 43.59,2.38 v41.91,2.38
  Bottom 0.305: C59.P$1 57.55,33.85 LT1.7 | IC1.16 86.18,45.91 v88.09,43.99 | MCU.48 52.06,41.02 C10.P$2 | MCU.64 46.19,32.32 C52.+ | LT_3.P$18 25.43,33.16 C50.P$1 v26.52,33.17 | LT_3.P$8 19.95,33.16 19.66,32.86 v18.45,32.86 | v25.76,37.28 26.81,37.28 C47.+ 27.91,37.27 28.16,37.02 REG_1V8.1 | v43.9,28.29 43.9,32.25 43.6,32.55 43.59,32.55 MCU.1 | 48.31,12.29 v49.23,13.21 52.2,13.21 52.21,13.21 R34.P$2 R33.P$2 | MCU.19 38.28,42.47 v38.26,42.47 37.71,43.01 C12.P$2 | L3.P$1 31.55,36.53 v31.55,37.59
  Bottom 0.406: v44.66,47.19 44.32,47.19 C41.P$2 | v53.04,39.88 53.04,40.33 C10.P$2 | C10.P$2 53.8,41.09 | C10.P$2 | v57,42.47 57.46,42.92 CON_USART3.3 | v46.18,30.27 C52.+ | v33.23,46.43 32.77,46.43 32.01,45.67 CON_USART2.3
  Bottom 1.626: REG_3V3D.P$3 11.64,29.72
  pour Route15: 0,49.32 89.77,49.32 89.77,30.58 74.53,30.58 74.53,0.25 0,0.25
  pour Bottom (no thermals): 11.13,31.19 14.79,31.19 14.79,28.44 12.35,26.01 10.98,26.01 10.52,26.46 10.52,30.73 10.98,31.19
+3V3A  (via drill 0.35)
  Bottom 0.152: ADC2.P$8 84.95,9.04 85.04,8.94 85.04,7.57 84.42,6.94 C70.P$1 | 80.01,9.19 80.01,10.92 80.47,11.38 82,11.38 82.3,11.07 82.3,9.81 82.18,9.69 ADC1.P$1
  Bottom 0.203: R54.P$1 87.94,11.07 87.63,10.77 87.63,7.72 87.94,7.41 87.94,6.5 87.63,6.19 | C18.+ 79.58,6.94
  Bottom 0.305: 85.65,6.19 87.63,6.19 | 85.65,6.19 R64.P$2 | 79.56,6.19 81.08,6.19 | 81.08,6.19 84.13,6.19 | 84.13,6.19 85.65,6.19 | 79.56,6.19 C18.+ v79.56,7.87 79.25,8.18 C71.P$1 79.62,8.8 80.01,9.19 ADC1.P$8 | 81.08,6.19 R12.P$1 | 84.13,6.19 C70.P$1 | 79.56,6.19 78.8,6.19 78,5.4 REG3V3A.5
  pour Route15: 89.62,29.82 75.44,29.82 75.44,0.1 89.62,0.1
+5V  (via drill 0.35)
  Top 0.152: v46.33,38.2 45.57,38.2 44.66,39.11 42.37,39.11 41.76,38.5 39.48,38.5 37.49,36.52 v37.49,35
  Top 0.203: CON_OV_SPI.2 20.35,30.81
  Top 0.254: R70.P$1 15.85,26.63 15.85,29.66 14.79,30.73 14.79,30.81 | CON_MC2.4 35.95,5.57 37.04,6.65 v37.49,6.65 | v45.88,43.23 46.03,43.23 46.81,44 CON_MC1.4
  Top 0.356: 28.81,44.9 30.18,46.28
  Top 0.406: v52.89,45.21 52.12,45.21 49.23,48.1 43.44,48.1 v40.69,45.36 | 24.08,7.72 v24.39,7.72 | 30.18,46.28 v30.94,46.28 32.31,46.28 33.23,45.36 33.23,44.58 CON_OV_UART1.2 | CON_SERVOS_1.8 7.18,44.57 | CON_USART1.2 20.23,14.68 20.73,15.19 21.64,15.19 22.41,14.42 22.41,13.66 21.8,13.05 21.34,13.05 20.35,12.06 20.35,7.49 | 32.16,12.14 30.94,12.14 v30.48,11.68 | 32.16,12.14 41.76,12.14 | 41.76,12.14 43.43,12.14 | 43.43,12.14 43.44,12.14 | R60.P$1 32.17,12.13 32.16,12.14 | R56.P$2 32.17,12.15 32.16,12.14 | 43.43,12.14 43.74,11.83 44.81,10.75 v44.81,6.5 46.64,6.5 v46.79,6.35 | 43.43,12.14 43.44,12.14 | 43.43,12.14 43.44,12.14 | 43.44,12.14 50.07,12.14 50.83,11.38 v51.97,11.38 51.97,7.03 v52.2,6.8 | 41.76,12.14 v41.76,12.52
  Top 0.61: 7.47,46.88 10.98,46.88 | 10.98,46.88 13.87,46.88 14.73,46.03 | 7.47,46.88 7.23,46.64 CON_SERVOS_1.8 7.23,42.88 C14.P$2 | 10.98,46.88 CON_SERVOS_1.5 10.98,42.86 C13.P$2 | 14.73,46.03 CON_SERVOS_1.2 14.73,42.84 C30.P$2 | 7.47,46.88 6.25,46.88 4.88,45.51 4.88,40.79 arc90 4.96,40.71 5.34,40.33 5.34,30.43 | 4.88,7.95 4.88,6.96 4.88,4.21 6.4,2.69 v7.78,2.69 8.08,2.69 | 4.88,7.95 4.88,8.48 5.19,8.79 5.19,21.99 REG_5VD.P$3 2.75,24.43 2.75,27.83 5.34,30.43 | 8.08,2.69 10.98,2.69 | 10.98,2.69 14.18,2.69 14.73,3.24 | 14.73,3.24 CON_SERVOS_2.8 14.73,6.34 C28.P$2 | 10.98,2.69 CON_SERVOS_2.5 10.98,6.28 C25.P$2 | CON_SERVOS_2.2 7.23,4.31 8.08,3.45 8.08,2.69 | 14.73,3.24 16.1,3.24 20.35,7.49 20.58,7.72 24.08,7.72 | 14.73,46.03 16.56,46.03 18.9,43.69 25.91,43.69 27.13,44.9 28.81,44.9 | v24.39,7.72 26.52,7.72 v30.48,11.68 | CON_OV_SPI.2 14.79,30.81 5.72,30.81 5.34,30.43 | C69.P$2 4.89,7.93 4.88,7.95
  Bottom 0.152: v46.33,38.2 45.88,38.66 v45.88,43.23
  Bottom 0.254: CON_I2C2.2 46.08,5.78 46.64,6.35 v46.79,6.35 | v37.49,35 39.17,33.32 39.17,20.37 41.76,17.78 v41.76,12.52 R30.P$1 | v37.49,6.65 41.15,6.65 41.77,7.27 R46.P$1 | R44.P$2 R43.P$2 | v51.97,11.38 51.97,11.83 51.68,12.13 R25.P$2 | CON_I2C2.4 43.58,5.57 44.5,6.5 v44.81,6.5
  Bottom 0.305: R30.P$1 R45.P$1 R46.P$1 41.76,8.16
  Bottom 0.406: v40.69,45.36 35.97,45.36 33.99,47.34 32.01,47.34 v30.94,46.28 30.76,46.09 CON_USART2.2 | v52.89,45.21 53.65,45.21 54.26,45.82 55.78,45.82 56.21,45.39 CON_USART3.2 | CON_OV_USBH.2 32.48,6.03 31.4,7.11 31.4,10.77 | v30.48,11.68 31.4,10.77 | 31.4,10.77 32.02,10.14 C29.P$1 32.61,10 U1.3 | R44.P$2 51.59,6.19 v52.2,6.8
  Bottom 0.61: CON_LIGHTS.6 7.09,4.44 7.78,3.76 v7.78,2.69 | PWS1.5 24.15,6.72 24.39,6.96 v24.39,7.72 24.39,9.55 24.09,9.84 PWS2.5
  pour Bottom (no thermals): 5.49,18.39 1.38,18.39 0.92,18.84 0.92,23.72 5.34,23.72 5.64,23.42 5.64,18.39
+5VA  (via drill 0.35)
  Top 0.305: BARO_DIF.P$2 84.08,20.01 83.22,19.15 v83.22,18.23 | C27.P$1 78.49,28.75 79.86,27.38 v79.86,26.77 79.46,26.36 BARO_ABS.P$2 | v80.62,21.74 80.78,21.89
  Top 0.356: v79.86,26.77 81.23,26.77 82.15,25.85 82.15,23.26 | v80.62,21.74 82.15,23.26 | BARO_DIF.P$2 84.46,21.71 84.28,21.89 | 84.28,21.89 82.91,23.26 82.15,23.26 | C68.P$1 84.74,22.35 84.28,21.89
  Bottom 0.254: 81.39,18.98 C8.P$1 | R5.P$1 78.34,11.53
  Bottom 0.305: REG5VA.5 79.14,26.87 C26.+ 79.24,26.77 v79.86,26.77 | R38.P$1 84.13,19.15 v83.22,18.23 | 81.39,15.64 U90.4
  Bottom 0.406: v80.62,21.74 81.37,20.99 C8.P$1 | 81.39,18.98 81.39,15.64 81.39,13.81 79.1,11.53 R5.P$1
+6V5  (via drill 0.35)
  Top 0.305: 75.75,22.04 75.75,18.54 75.75,18.08 76.05,17.78 76.05,13.21 v73.46,10.61 | 68.43,20.21 R4.P$2
  Top 0.356: v80.01,22.65 76.36,22.65 75.75,22.04
  Top 0.406: 69.5,28.14 68.43,27.07 68.43,20.21 70.11,18.54 75.75,18.54
  Top 0.61: CON_SPI_IMU.3 68.3,29.34 69.5,28.14 69.94,27.7 C20.P$1 | 70.4,27.68 70.26,27.68
  Bottom 0.203: REG3V3A.1 76.02,5.4 76.36,5.74 76.36,6.96 76.02,7.3 REG3V3A.3 | v73.46,10.61 70.72,7.87 70.41,7.57 U$1.P$1
  Bottom 0.305: REG5VA.3 77.24,23.68 77.58,24.03 78.95,24.03 79.1,23.87 79.1,23.07 REG5VA.1 | REG3V3A.1 73.81,5.4 C16.+ 73.45,5.44 72.85,6.04 72.85,10 v73.46,10.61
  Bottom 0.356: v80.01,22.65 80.01,22.51 C57.+ 79.24,22.93 REG5VA.1
  pour Top (no thermals): 69.5,27.84 75.14,27.84 75.14,20.37 69.35,20.37 69.35,27.84
+12V
  Top 0.254: REG_5VD.P$1 10.67,23.62 10.67,23.87
  Top 0.305: R16.P$2 30.94,23.87
  Top 0.61: REG6V5A.3 74.74,14.33 73.46,13.05 68.43,13.05 | 68.43,13.05 62.41,13.05 51.59,23.87 30.94,23.87 10.67,23.87 | 68.43,13.05 C21.P$1
  Top 1.219: REG_3V3D.P$1 6.66,24.94 9.35,24.94 REG_5VD.P$1
  pour Bottom (no thermals): 10.52,18.39 10.52,23.26 10.98,23.72 12.35,23.72 12.65,23.42 14.94,21.13 14.94,18.39
  pour Bottom (no thermals): 0.61,31.19 5.34,31.19 5.8,30.73 5.8,26.31 4.42,24.94 0.31,24.94 0.31,31.19
BARO_1_DRDY  (via drill 0.35)
  Top 0.152: v42.52,20.98 44.66,18.84 51.06,18.84 55.48,14.42 55.48,13.05 57.46,11.07 57.46,8.94 59.52,6.88 74.3,6.88 79.25,11.83 v82.45,11.83
  Bottom 0.152: ADC1.P$2 82.4,9.19 82.61,9.39 82.61,11.68 v82.45,11.83
  Bottom 0.203: MCU.8 40.24,34.14 40.24,23.26 v42.52,20.98
BARO_2_DRDY  (via drill 0.35)
  Top 0.152: v43.74,20.82 45.42,19.15 51.21,19.15 55.78,14.58 55.78,13.21 57.76,11.22 57.76,9.09 59.67,7.18 74.15,7.18 79.41,12.44 82.76,12.44 v83.67,11.53
  Bottom 0.152: ADC2.P$2 84.95,11.32 84.59,11.68 83.82,11.68 v83.67,11.53
  Bottom 0.203: MCU.6 40.69,33.19 40.69,23.87 v43.74,20.82
CAN_H  (via drill 0.35)
  Top 0.152: v39.78,40.33 40.39,40.94 45.57,40.94 46.18,40.33 47.1,40.33 48.47,41.7 48.47,42.16 48.06,42.57 CON_MC1.3 | v35.36,35 35.36,37.28 v37.04,38.96
  Top 0.254: CON_MC2.3 34.7,6 37.34,8.63 | 37.34,8.63 v38.26,8.63 | 37.34,8.63 R57.P$1
  Top 0.406: R58.P$1 36.12,9.71 R57.P$1
  Bottom 0.152: v37.04,38.96 37.65,39.57 39.02,39.57 v39.78,40.33
  Bottom 0.254: v38.26,8.63 38.36,8.73 U1.7
  Bottom 0.305: v38.26,8.63 37.34,9.55 37.34,12.9 37.49,13.05 37.49,32.86 v35.36,35
CAN_L  (via drill 0.35)
  Top 0.152: v40.85,40.33 41.15,40.64 45.42,40.64 46.03,40.03 47.25,40.03 49.31,42.08 CON_MC1.2 | v36.43,35 36.43,37.13 v38.1,38.81
  Top 0.254: CON_MC2.2 33.45,5.81 35.36,7.72 35.36,10.16 35.67,10.46 36.12,10.46 | 36.12,10.46 v38.1,10.46 | R59.P$2 36.11,10.47 36.12,10.46
  Top 0.406: R59.P$2 37.33,11.22 R57.P$2
  Bottom 0.152: v38.1,38.81 38.41,39.11 39.63,39.11 v40.85,40.33
  Bottom 0.254: v38.1,10.46 38.56,10 U1.6
  Bottom 0.305: v38.1,10.46 38.1,33.17 36.43,34.85 v36.43,35
FT_1V8  (via drill 0.35)
  Top 0.254: 68.13,40.32 v68.13,41.7 | 68.13,40.32 C79.+ 67.35,40.32 66.76,39.72 66.76,38.66 67.36,38.05 67.97,38.05 68.58,37.44 68.58,35.6 C86.P$2 | 68.13,40.32 C80.P$2 70.1,39.57 73.92,39.57 | C85.P$2 75.29,36.06 74.83,36.52 74.83,39.27 74.53,39.57 73.92,39.57 | 73.92,39.57 C87.P$2
  Top 0.305: C85.P$2 77.12,36.06 v77.88,35.3
  Top 0.356: C86.P$2 v66.91,34.85
  Top 0.406: C87.P$2 74.67,40.32 v76.51,42.16
  Bottom 0.254: IC3.P$12 77.5,35.08 77.88,35.45 v77.88,35.3 | v66.91,34.85 67.14,35.08 IC3.P$37 | IC3.P$49 68.8,41.64 68.74,41.7 v68.13,41.7
  Bottom 0.305: IC3.P$64 76.3,41.95 v76.51,42.16
FT_3V3  (via drill 0.35)
  Top 0.254: C91.P$2 72.39,40.33 v72.39,42.16 | C89.P$2 70.57,31.8 v70.11,31.34 | C88.P$2 74.39,31.34 v74.53,31.34 | v73.46,44.29 74.53,45.36 v77.42,45.36 77.88,45.82 R15.P$2
  Top 0.305: 70.87,40.33 C78.P$2 | R76.P$1 74.84,35.3 76.05,35.3 76.81,34.54 78.49,34.54 v79.56,33.47
  Top 0.356: C78.P$2 70.87,40.79 69.54,42.12 v69.3,42.12 | R76.P$1 74.08,33.49 73.47,32.88 C88.P$2 C89.P$2 67.66,32.88 66.15,34.39 66.15,36.37 | 71.63,40.33 71.63,40.79 69.65,42.77 68.13,42.77 66.15,40.79 66.15,36.37 | 66.15,36.37 67.22,36.37 C90.P$2 67.22,37.59 v66.91,37.59
  Top 0.406: 72.39,40.33 71.63,40.33 70.87,40.33
  Bottom 0.152: IC2.6 76.28,45.02
  Bottom 0.203: R77.P$2 76.65,44.66 76.28,45.02 | IC2.6 77.24,45.17 v77.42,45.36 | v72.39,42.16 73,42.16 73.46,42.62 v73.46,44.29
  Bottom 0.254: v69.31,42.12 v69.3,42.12 IC3.P$50 | IC3.P$42 68.13,37.59 v66.91,37.59 | v70.11,31.34 69.96,31.34 69.3,32 IC3.P$31 | v74.53,31.34 74.8,31.61 IC3.P$20 | IC3.P$56 72.3,42.06 v72.39,42.16
  Bottom 0.305: L1.P$1 L2.P$1 C75.+ 83.06,36.38 83.06,34.08 82.45,33.47 v79.56,33.47
  pour Bottom (no thermals): 81.69,36.98 84.74,36.98 84.74,35.61 83.06,35.61 83.06,35.76 81.69,35.76
FT_5V  (via drill 0.35)
  Top 0.203: CON_USB1.1 82.22,34.92
  Top 0.305: CON_USB1.1 81,34.92 78.8,37.13 78.8,37.74 79.25,38.2 v80.32,38.2
  Bottom 0.305: 85.65,35.72 FT_VREG3V3.1 | FT_VREG3V3.3 85.65,33.82 85.65,35.72 | 85.64,36.83 C76.+ 85.65,35.72 | 85.64,36.83 87.16,36.83 C77.P$2 | 85.64,36.83 84.88,37.59 80.93,37.59 v80.32,38.2
FT_USB_DM  (via drill 0.35 pad 0.4)
  Top 0.203: v79.56,37.44 79.56,36.98 80.81,35.72 CON_USB1.2 82.49,35.72
  Bottom 0.254: IC3.P$7 79.41,37.59 v79.56,37.44
FT_USB_DP  (via drill 0.35 pad 0.4)
  Top 0.203: CON_USB1.3 80.93,36.52 v80.47,36.98
  Bottom 0.203: IC3.P$8 78.7,37.08 78.95,36.83 80.32,36.83 v80.47,36.98
GND  (via drill 0.35, 0.35 pad 0.4)
  Top 0.152: IC6.1 37.33,17.94
  Top 0.203: C65.P$2 40.09,20.21 C66.P$2 | v32.47,18.69 31.92,19.24 IC6.14 30.24,19.24 29.88,19.61 C67.P$1 | IC6.1 36.91,17.19 v36.73,17.02 | C49.P$2 30.38,30.06 IC4.14 34.51,30.06 35.81,28.76 IC4.1 | 40.09,31.04 v41.46,31.04
  Top 0.254: R55.P$1 v39.17,13.05 | 47.71,31.49 C52.- | v55.02,23.11 55.04,23.09 CON_I2C_IMU.1
  Top 0.305: C6.P$1 40.09,31.04 C48.P$1 | R3.P$1 C21.P$2 68.28,15.17 68.28,15.64 v67.36,15.64 | C49.P$2 28.96,30.58 v28.81,30.73 | R17.P$1 v35.82,25.24 | 40.09,20.21 v41.15,20.21 | v71.94,46.28 v71.95,46.29 LED_JTXD.C LED_JRXD.C LED_FT.C | CON_SPARE.1 48.01,5.66 v48.01,6.35
  Top 0.406: R61.P$2 C42.P$1 32.2,8.14 32.2,6.5 | CON_SERVOS_1.1 16.34,44.57 v16.92,43.99 | v30.48,47.34 33.53,47.34 34.49,46.38 CON_OV_UART1.1 | C80.P$1 C78.P$1 C91.P$1 | CON_OV_SPI.1 19.79,28.26 v18.45,26.92 | CON_USB1.5 82.38,38.12 83.06,38.81 83.52,38.81 v83.98,39.27 | C23.P$1 46.64,29.21 v47.71,30.27 47.71,31.49 | v46.03,47.19 49.08,47.19 50.6,45.67 50.6,44.61 CON_MC1.1 | v16.46,11.38 16.54,11.45 C38.- 19.79,12.79 CON_USART1.1 | CON_MC2.1 32.2,6.5 | 32.2,6.5 v33.08,6.5 | Q7.2 47.02,33.02 47.69,32.35 C52.-
  Top 0.61: v8.54,45.97 8.48,45.91 CON_SERVOS_1.7 8.48,43.46 C14.P$1 | v12.2,45.97 12.23,45.94 CON_SERVOS_1.4 12.23,43.47 C13.P$1 | v6.71,3.6 5.98,4.34 CON_SERVOS_2.1 5.98,6.31 C69.P$1 | v9.76,3.6 9.73,3.63 CON_SERVOS_2.4 9.73,6.84 C25.P$1 | v13.42,3.6 13.48,3.66 CON_SERVOS_2.7 13.48,6.78 C28.P$1 | C30.P$1 15.98,43.49 CON_SERVOS_1.1
  Bottom 0.152: J3&4.AGND 63.41,20.52 64.16,19.76 64.16,9.39 66.3,7.26 66.83,7.26 67.21,6.88 U$4.P$1
  Bottom 0.203: J3&4.GND 23.39,15.72 v23.02,16.1 | LT_I2C2.1 55.79,9.4 | IC3.P$1 76.45,40.58 76.2,40.33 | J3&4.GND@33 25.73,27.72 v26.06,27.38 | C9.P$1 v66.15,42.77 | 78.8,34.24 78.95,34.39 C84.P$2
  Bottom 0.254: J3&4.GND@70 61.95,28.52 61.42,27.99 v61.42,27.38 | J3&4.GND@56 61.77,22.92 v61.57,23.11 | J3&4.AGND 61.73,20.52 v61.57,20.67 | MCU.31 42.51,46.72 C41.P$1 | IC3.P$25 72.3,35.15 72.09,35.15 | 74.22,36.08 IC3.P$10 | IC3.P$11 74.38,35.58 74.38,35.61 | 74.8,34.58 IC3.P$13 | IC3.P$15 75.8,33.58 74.8,34.58 | 74.8,34.58 74.22,35.15 | 74.68,38.58 74.6,38.58 74.22,38.2 | 74.68,38.58 IC3.P$5 | IC3.P$47 69.3,40.08 69.8,39.58 | 69.8,39.58 IC3.P$51 | 69.8,39.58 71.02,38.35 | IC3.P$35 69.8,34.08 70.72,35 | C59.P$2 57.18,31.67 v57.15,31.64 | LT1.2 63.47,33.85 C60.P$2 | C50.P$2 v25.45,35.76 26.81,35.76 C47.- | IC2.2 72.09,46.12 v71.94,46.28 | 76.2,40.33 74.68,38.81 74.68,38.58 | 55.79,9.4 55.79,10.32 56.09,10.61 v56.85,10.61 | IC1.13 84.23,48.31 83.82,48.71 78.03,48.71 | Q3.P$2 80.23,42.99 C72.P$1 80,42.17 v80.47,41.7 | Q3.P$4 78.2,46.64 C73.P$1 78.2,48.55 78.03,48.71 | 78.03,48.71 77.27,48.71 v77.12,48.56 | CON_OV_USBH.1 33.73,5.84 v33.08,6.5
  Bottom 0.305: 87.94,34.77 FT_VREG3V3.2 | 87.94,34.77 87.94,38.05 87.65,38.34 C77.P$1 | C74.P$1 87.63,32.41 87.94,32.71 87.94,34.77 | IC1.1 87.03,41.86 R13.P$1 87.33,41.56 87.33,39.27 | R52.P$1 86.73,39.28 | MCU.47 52.42,42.08 C10.P$1 | MCU.63 47.69,32.35 C52.- | v18.45,33.93 18.72,33.66 LT_3.P$9 21.89,33.66 LT_3.P$21 | C47.- 27.45,35.15 28.81,35.15 29.11,35.45 REG_1V8.2 | C16.- 74.36,6.35 REG3V3A.2 | C81.- C83.P$2 v80.47,41.7 | C84.P$2 C82.- | v78.8,32.71 78.8,34.24 | R66.P$1 C62.- | MCU.12 39.17,35.91 v39.17,35.76 | 26.67,31.64 27.27,31.05 C46.- 28.49,31.05 v28.81,30.73 | C60.P$2 64.63,33.16 65.54,32.25 v65.54,31.95 | C51.P$2 26.51,30.44 v26.67,30.27 | 55.01,43.54 54.96,43.59 | MCU.18 38.34,41.7 37.48,41.7 C12.P$1 36.87,41.93 v36.28,41.93 | R23.P$1 52.58,31.49 v52.73,31.64 | CON_I2C2.1 48.01,5.69 v48.01,6.35
  Bottom 0.356: C19.P$2 73.77,8.48 73.61,8.33 v73.61,7.87 73.61,6.96 73.75,6.96 C16.-
  Bottom 0.406: v41,47.65 41.76,47.65 42.37,47.04 42.35,47.04 arc-90 C41.P$1 | C10.P$1 52.74,42.16 52.43,42.16 v52.43,43.08 | R66.P$1 C61.P$2 62.78,5.88 v62.03,5.13 | 55.01,43.54 55.48,43.08 v55.78,43.08 | v47.71,30.27 47.71,31.48 C52.- | v33.08,38.2 33.06,38.19 C7.P$1 C15.- | LT_I2C1.1 49.52,9.38 v49.99,9.85 49.53,10.31 C33.P$2 | 54.96,43.59 CON_USART3.1 | CON_USART2.1 29.51,46.67 30.18,47.34 v30.48,47.34 | C34.P$2 v43.9,13.05 | U1.2 32.55,8.73 C29.P$2 32.47,7.11 v33.08,6.5
  Bottom 0.61: CON_LIGHTS.5 8.34,4.41 9.15,3.6 v9.76,3.6 10.37,3.6 10.84,4.08 CON_LIGHTS.3 | C37.P$2 v16.46,11.38 16.46,11.45 C38.- 19.11,10.79 PWS2.2 | CON_LIGHTS.1 13.34,3.68 v13.42,3.6 | C39.P$2 16.46,4.44 C40.- 18.98,4.44 v19.97,5.43 21.04,5.43 21.8,6.19 21.8,7.41 21.54,7.67 PWS1.2 | R62.P$1 9.52,37.5 9.45,37.44 | R14.P$1 6.71,10.45 6.71,12.29 | ~NUDEV~1.GND 73.77,4.19 v73.77,2.99
  other vias: 71.94,37.44 73.16,37.44 71.94,36.22 73.16,36.22 69.65,29.51 73.77,19.45
  pour Route2: 74.58,0.28 74.58,30.58 89.62,30.58 89.67,49.3 0.01,49.3 0.01,0.28
  pour Top (no thermals): 67.52,39.11 74.38,39.11 74.38,35.61 73.46,35.61 73.46,34.08 69.19,34.08 69.19,38.5 67.52,38.5
  pour Bottom (no thermals): 70.57,38.81 74.53,38.81 74.53,34.85 70.57,34.85
  pour Top (no thermals): 75.14,29.66 71.78,29.66 71.63,29.51 71.63,28.9 69.8,28.9 68.43,30.27 66.3,30.27 66.3,32.25 67.97,32.25 69.8,30.43 74.22,30.43
  pour Bottom (no thermals): 0.61,37.59 14.79,37.59 14.79,32.25 13.87,32.25 13.87,34.39 13.26,35 9.45,35 9.3,34.85 9.3,15.19 9.76,14.73 13.26,14.73 13.87,15.34 13.87,17.47 14.94,17.47 14.94,11.99 0.31,11.99 0.31,17.01 0.61,17.32 1.83,17.32 1.83,16.71 6.56,16.71 6.86,17.01 6.86,35 6.71,35.15 2.9,35.15 2.14,34.54 2.14,32.25 0.61,32.25
  pour Bottom (no thermals): 83.52,38.2 83.21,38.5 83.21,39.11 83.52,39.42 87.63,39.42 87.79,39.27 87.79,38.35 87.63,38.2
  pour Bottom (no thermals): 75.29,23.87 75.29,21.89 73.31,19.91 73.31,19.3 73.61,19 74.07,19 76.36,21.28 78.49,21.28 78.49,23.57 77.88,23.57 77.88,22.2 76.51,22.2 76.51,23.87
GNDA  (via drill 0.35)
  Top 0.254: 78.34,18.23 78.8,17.78 v80.17,17.78
  Top 0.305: BARO_ABS.P$3 76.35,25.1 75.9,25.55 v75.9,26.77 75.9,28.28 C27.P$2 | v83.22,21.74 82.15,21.74 81.84,21.43 81.84,20.01 BARO_DIF.P$3 | C68.P$2 88.38,21.29 v88.4,21.28 | R2.P$2 78.02,18.55 78.34,18.23
  Bottom 0.152: ADC2.P$3 85.45,11.43 84.89,11.99 84.13,11.99 83.52,12.6 | 83.52,12.6 v83.52,13.05 | 84.45,11.06 ADC2.P$1 84.42,10.92 83.37,10.92 83.06,11.22 83.06,12.14 83.52,12.6 | ADC1.P$3 82.86,8.69 v82.91,8.63
  Bottom 0.203: R68.P$1 87.18,4.98 87.02,4.82 84.75,4.82 C70.P$2 R53.P$1 81.98,4.82 80.18,4.82 C18.- | R63.P$1 88.4,9.54 v88.4,8.33
  Bottom 0.254: C36.P$1 85.49,15.64 U90.11 83.82,15.64 83.52,15.34 v83.52,13.05 | R39.P$2 83.67,20.67 83.22,21.13 v83.22,21.74 | C8.P$2 80.17,18.7 v80.17,17.78
  Bottom 0.305: v75.9,26.77 76.2,27.07 C26.- | R6.P$2 78.19,9.84 v78.19,8.79
  Bottom 0.356: R35.P$1 v83.67,26.01
  Bottom 0.406: R6.P$2 78.96,10 C71.P$2
  Bottom 0.61: ~NUDEV~1.GNDA 76.36,4.19 v76.36,2.99
  other vias: 78.03,4.37
  pour Route2: 89.62,29.82 75.44,29.82 75.44,0.1 89.62,0.1
  pour Bottom (no thermals): 87.63,5.58 77.58,5.58 77.58,3.76 78.49,3.76 79.1,4.37 87.63,4.37
  pour Bottom (no thermals): 75.59,18.84 75.59,19.76 75.9,20.06 76.36,20.52 80.01,20.52 80.47,20.06 80.47,17.93 80.47,17.62 80.32,17.47 80.01,17.47 79.71,17.78 79.71,19.3 79.4,19.61 76.97,19.61 76.66,19.3 76.66,18.84 76.51,18.69 75.75,18.69
GPIO41_OTG_ID
  Bottom 0.203: CON_OV_USB_OTG.5 54.65,6.44 55.02,6.8 56.7,6.8 59.74,9.85 59.74,12.14 61.42,13.81 61.42,18.54 61.8,18.92 J3&4.USBOTG_ID
GPIO144_PWM9_BSP3_DX  (via drill 0.35)
  Top 0.152: v57.69,13.66 57.69,13.21 61.12,9.78 65.77,9.78 66.98,11 U$8.P$1
  Bottom 0.152: J3&4.GPIO144_GPT9_PWM 57.59,21.72 57.15,21.28 57.15,14.2 v57.69,13.66
GPIO145_PWM10_BSP3_DR  (via drill 0.35)
  Top 0.152: v60.81,22.5 60.96,22.35 60.96,15.72 62.18,14.5 v65.69,14.5 | v65.38,10.69 64.24,11.83 U$10.P$1
  Bottom 0.152: J3&4.GPIO145_GPT10_PWM 62.68,22.5 v60.81,22.5 | v65.69,14.5 65.38,14.2 v65.38,10.69
GPIO146_PWM11_BSP3_CLKX  (via drill 0.35)
  Top 0.152: v58.3,14.27 58.3,13.05 61.27,10.08 65.61,10.08 66.15,10.61 66.15,11.38 U$9.P$1
  Bottom 0.152: J3&4.GPIO146_GPT11_PWM 57.61,20.52 57.46,20.37 57.46,14.65 57.84,14.27 v58.3,14.27
GPIO147_PWM8_BSP3_FSX  (via drill 0.35)
  Top 0.152: v57,13.13 57.31,13.13 60.96,9.47 66.45,9.47 68.36,11.38 U$7.P$1
  Bottom 0.152: J3&4.GPIO147_GPT8_PWM 57.63,22.52 56.85,21.74 56.85,13.28 v57,13.13
GPIO165_IR_RXD3
  Bottom 0.203: LT1.4 60.65,32.85 59.52,31.72 59.52,17.09 58.94,16.52 J3&4.GPIO165_IR_RXD3
GPIO166_IR_TXD3
  Bottom 0.152: LT1.5
  Bottom 0.203: J3&4.GPIO166_IR_TXD3 58.81,18.52 59.14,18.84 59.14,32.25 58.68,32.71 LT1.5
HSOL
  Bottom 0.152: J3&4.HSOLF 63.52,27.72 64.01,27.23 64.01,20.37 64.47,19.91 64.47,9.55 66.45,7.57 67.75,7.57 68.28,7.03 U$3.P$1
HSOR
  Bottom 0.152: J3&4.HSORF 63.58,28.12 64.32,27.38 64.32,20.52 64.77,20.06 64.77,9.7 66.6,7.87 68.66,7.87 69.35,7.18 U$2.P$1
INT/TRIGGER
  Top 0.203: R48.P$2 27.58,19 21.19,19 20.5,19.68 CON_USART1.6
LED_1_G  (via drill 0.35 pad 0.4)
  Top 0.152: LED_1.3 85.5,45.66
  Top 0.203: LED_1.3 85.54,45.1 v84.89,44.45
  Bottom 0.152: IC1.5 83.58,42.37 84.13,42.92 84.43,42.92 84.74,43.23 84.74,44.29 v84.89,44.45
LED_1_R  (via drill 0.35 pad 0.4)
  Top 0.152: 84.59,45.7 LED_1.2 84.43,45.55
  Top 0.203: 84.43,45.55 84.43,44.9 84.13,44.6 v84.13,43.53
  Bottom 0.152: IC1.6 82.93,42.33 v84.13,43.53
LED_2_G  (via drill 0.35 pad 0.4)
  Top 0.203: LED_2.3 83.64,44.72 v83.37,44.45
  Bottom 0.152: IC1.7 82.28,42.59 82.61,42.92 83.06,42.92 83.37,43.23 v83.37,44.45
LED_2_R  (via drill 0.35 pad 0.4)
  Top 0.203: LED_2.2 82.69,43.6 v82.76,43.53
  Bottom 0.152: IC1.8 81.63,42.7 82.45,43.53 v82.76,43.53
LED_3_G  (via drill 0.35 pad 0.4)
  Top 0.152: 81.69,45.66 LED_3.3
  Top 0.203: v81.84,44.45 81.69,44.6 81.69,45.66
  Bottom 0.152: IC1.9 81.63,44.66 v81.84,44.45
LED_3_R  (via drill 0.35 pad 0.4)
  Top 0.203: LED_3.2 80.78,44.13 v81.39,43.53
  Bottom 0.152: v81.39,43.53 81.84,43.53 82.58,44.27 82.58,44.62 82.28,44.93 IC1.10
LED_4_G  (via drill 0.35 pad 0.4)
  Top 0.203: LED_4.3 87.45,44.57 86.41,43.53 v85.5,43.53
  Bottom 0.152: IC1.11 82.93,47.02 83.22,46.73 83.52,46.73 85.5,44.75 v85.5,43.53
LED_4_R  (via drill 0.35 pad 0.4)
  Top 0.203: LED_4.2 86.5,44.83 v86.11,44.45
  Bottom 0.152: IC1.12 83.58,47.13 86.11,44.6 v86.11,44.45
LINE_IN_LA
  Bottom 0.152: J3&4.AUXRF 63.5,16.92 63.86,16.56 63.86,9.24 66.15,6.96 U$5.P$1
LINE_IN_RA
  Bottom 0.152: J3&4.AUXLF 63.33,15.72 63.55,15.49 63.55,9.09 65.08,7.57 U$6.P$1
LT_I2C2_SCL
  Bottom 0.203: R26.P$2 52.05,8.85 52.05,8.48 51.67,8.11 LT_I2C2.6
  Bottom 0.254: LT_I2C2.6 50.61,8.11 50.14,7.64 50.14,6.65 49.85,6.36 R44.P$1 49.85,5.9 45.27,1.32 41.84,1.32 41.23,1.93 41.23,2.77 42.3,3.83 42.33,3.86 CON_I2C2.5
LT_I2C2_SDA
  Bottom 0.254: LT_I2C2.5 50.6,6.9 50.6,5.42 R43.P$1 49.23,4.67 45.42,0.86 41.61,0.86 40.69,1.78 40.69,2.92 41.08,3.3 CON_I2C2.6
  Bottom 0.305: R27.P$2 52.25,7.53 51.23,7.53 LT_I2C2.5
LT_USART1_RX
  Top 0.152: 36.42,22.49 IC6.8
  Top 0.203: 36.42,22.49 35.67,21.74 35.67,20.53 R37.P$1 34.75,17.78 33.84,16.86 29.42,16.86 27.86,18.42 19.82,18.42 19.8,18.42 | 19.8,18.42 19.65,18.42 | CON_USART1.5 19.8,18.42
LT_USART1_TX
  Top 0.203: IC6.13 32.95,19.89 R36.P$1 33.23,17.78 32.77,17.32 29.57,17.32 28.5,18.39 28.5,19.3 28.05,19.76 21.34,19.76 20.43,20.67 18.75,20.67 18.45,20.37 18.45,17.62 18.9,17.17 18.92,17.18 CON_USART1.4
N$1
  Bottom 0.152: R13.P$2 87.18,44.29 85.53,45.95 IC1.15
N$2  (via drill 0.35)
  Top 0.203: v41.44,33 41.46,33.02 Q7.3
  Bottom 0.203: MCU.5 41.44,33.23 v41.44,33
N$3
  Bottom 0.61: R62.P$2 12.88,39.29 REG_3V3D.P$4
N$4  (via drill 0.35)
  Top 0.152: 73.3,47.8 LED_JTXD.A
  Top 0.203: v70.87,47.8 73.3,47.8
  Bottom 0.203: R24.P$1 69.96,46.88 v70.87,47.8
N$6
  Bottom 0.152: 63.29,35.71 R49.P$1 63.4,35.76 63.45,35.71
  Bottom 0.203: IC3.P$16 76.95,31.63 75.59,30.27 68.28,30.27 63.45,35.1 63.45,35.71
N$7
  Bottom 0.203: IC3.P$54 71.3,41.73 70.87,42.16 70.26,42.16 69.96,42.47 R24.P$2
N$8
  Bottom 0.203: R12.P$2 81.39,6.94 | 81.39,6.94 R53.P$2 | 81.39,6.94 ADC1.P$5
N$9
  Bottom 0.254: R10.P$2 C36.P$2 85.65,14.27 84.92,15.01 U90.12
N$10
  Bottom 0.305: C56.P$1 76.3,25.63 REG5VA.4
N$11
  Bottom 0.406: R30.P$2 43.91,11.53 C34.P$1 44.77,10.63 44.75,10.61 | 44.75,10.61 LT_I2C1.8 LT_I2C1.7 | 44.75,10.61 44.75,10.67
N$12  (via drill 0.35)
  Top 0.203: v70.72,45.97 70.72,46.43 71.33,47.04 74.53,47.04 74.83,47.34 LED_JRXD.A
  Bottom 0.203: R71.P$1 71.48,45.21 v70.72,45.97
N$13
  Bottom 0.203: IC3.P$55 71.8,41.84 71.48,42.16 R71.P$2
N$15
  Bottom 0.203: ADC2.P$5 86.88,10.31 | 86.88,10.31 R54.P$2 | 86.88,10.31 R63.P$2
N$16
  Top 0.254: LED_FT.A R15.P$1
N$17
  Top 0.61: R72.P$1 13.48,43.38 CON_SERVOS_1.3
N$18
  Bottom 0.203: IC3.P$17 76.3,31.58 75.44,30.73 68.43,30.73 63.86,35.3 63.86,36.66 R50.P$1
N$19  (via drill 0.35)
  Top 0.254: R56.P$1 35.64,13.05 v35.81,13.22 35.97,13.05 R55.P$2
  Bottom 0.254: 36.58,7.87 36.99,7.46 U1.8 | 36.58,12.44 v35.81,13.22
  Bottom 0.305: 36.58,7.87 36.58,12.44
N$20
  Bottom 0.254: 51.16,10.53 R25.P$1
  Bottom 0.406: LT_I2C2.7 LT_I2C2.8 51.16,10.53 | C33.P$1 49.53,12.15 R25.P$1
N$21  (via drill 0.35)
  Top 0.356: BARO_ABS.P$4 79.2,23.82 v80.47,25.09
  Bottom 0.356: v80.47,25.09 82.14,25.09 R22.P$2
N$23
  Bottom 0.305: REG3V3A.4 77.81,7.93 77.26,8.48 C19.P$1
N$25
  Top 0.406: R61.P$1 R60.P$2 | R61.P$1 C42.P$2 | R61.P$1 R58.P$2 R59.P$1
N$28  (via drill 0.35)
  Top 0.305: R1.P$2 R2.P$1 76.51,18.98 76.51,18.84 v80.47,14.88
  Bottom 0.254: U90.3 80.34,15.01 v80.47,14.88
N$31
  Top 0.305: BARO_DIF.P$4 78.87,20.52 R1.P$1
N$33
  Top 0.305: REG6V5A.1 70.18,17.61 R3.P$2 R4.P$1
N$34
  Bottom 0.152: IC3.P$2 77.47,40.08 78.03,40.64 78.03,41.55 78.5,42.02 C72.P$2 78.5,43.78 78.2,44.08 Q3.P$3
N$35
  Bottom 0.152: IC3.P$3 77.43,39.58 78.34,40.48 78.34,41.4 79.25,42.31 79.25,45.59 Q3.P$1 80.23,47.42 C73.P$2
N$37
  Top 0.61: R73.P$1 9.73,43.4 CON_SERVOS_1.6
N$38
  Top 0.61: R74.P$1 5.98,43.4 CON_SERVOS_1.9
N$39  (via drill 0.35)
  Top 0.254: v78.2,38.66 76.5,38.66 75.58,37.74 R75.P$2
  Bottom 0.254: IC3.P$6 77.62,38.08 v78.2,38.66
N$40  (via drill 0.35)
  Top 0.305: R76.P$2 76.36,33.77 v78.05,33.77
  Bottom 0.254: IC3.P$14 77.73,34.08 v78.05,33.77
N$41
  Top 0.203: IC4.2 37.44,29.41 37.8,29.05 38.55,29.05 C5.P$1
N$42
  Top 0.203: IC4.4 37.82,30.71 37.96,30.57 C5.P$2
N$43
  Top 0.203: IC4.5 38.42,31.36 C35.P$1
N$44
  Top 0.203: IC4.6 37.57,32.01 C35.P$2
N$45
  Top 0.203: IC4.3 37.55,30.06 37.8,29.82 39.34,29.82 C6.P$2
N$46
  Top 0.203: IC4.7 37.6,32.66 37.8,32.86 37.8,33.47 37.95,33.63 39.78,33.63 40.09,33.32 C48.P$2
N$47
  Bottom 0.305: FT_VREG3V3.4 84.3,32.86 C74.P$2
N$48
  Bottom 0.254: IC3.P$4 77.54,39.08 77.88,39.42 80.33,39.42
  Bottom 0.305: L2.P$2 C81.+ C83.P$1 80.33,39.42
N$49